# Altium schematic sheet Sch_Buck.SchDoc
size A4; ENG_APP_DATE: --/--/--; DSN_APP_DATE: --/--/--; CHK_APP_DATE: --/--/--; CompanyName: Universidade Federal de Santa Maria; Organization: Universidade Federal de Santa Maria; Address1: Av. Roraima 1000; Address2: Camobi; Address3: Santa Maria - RS; Address4: Brasil; SheetNumber: 5; SheetTotal: 6
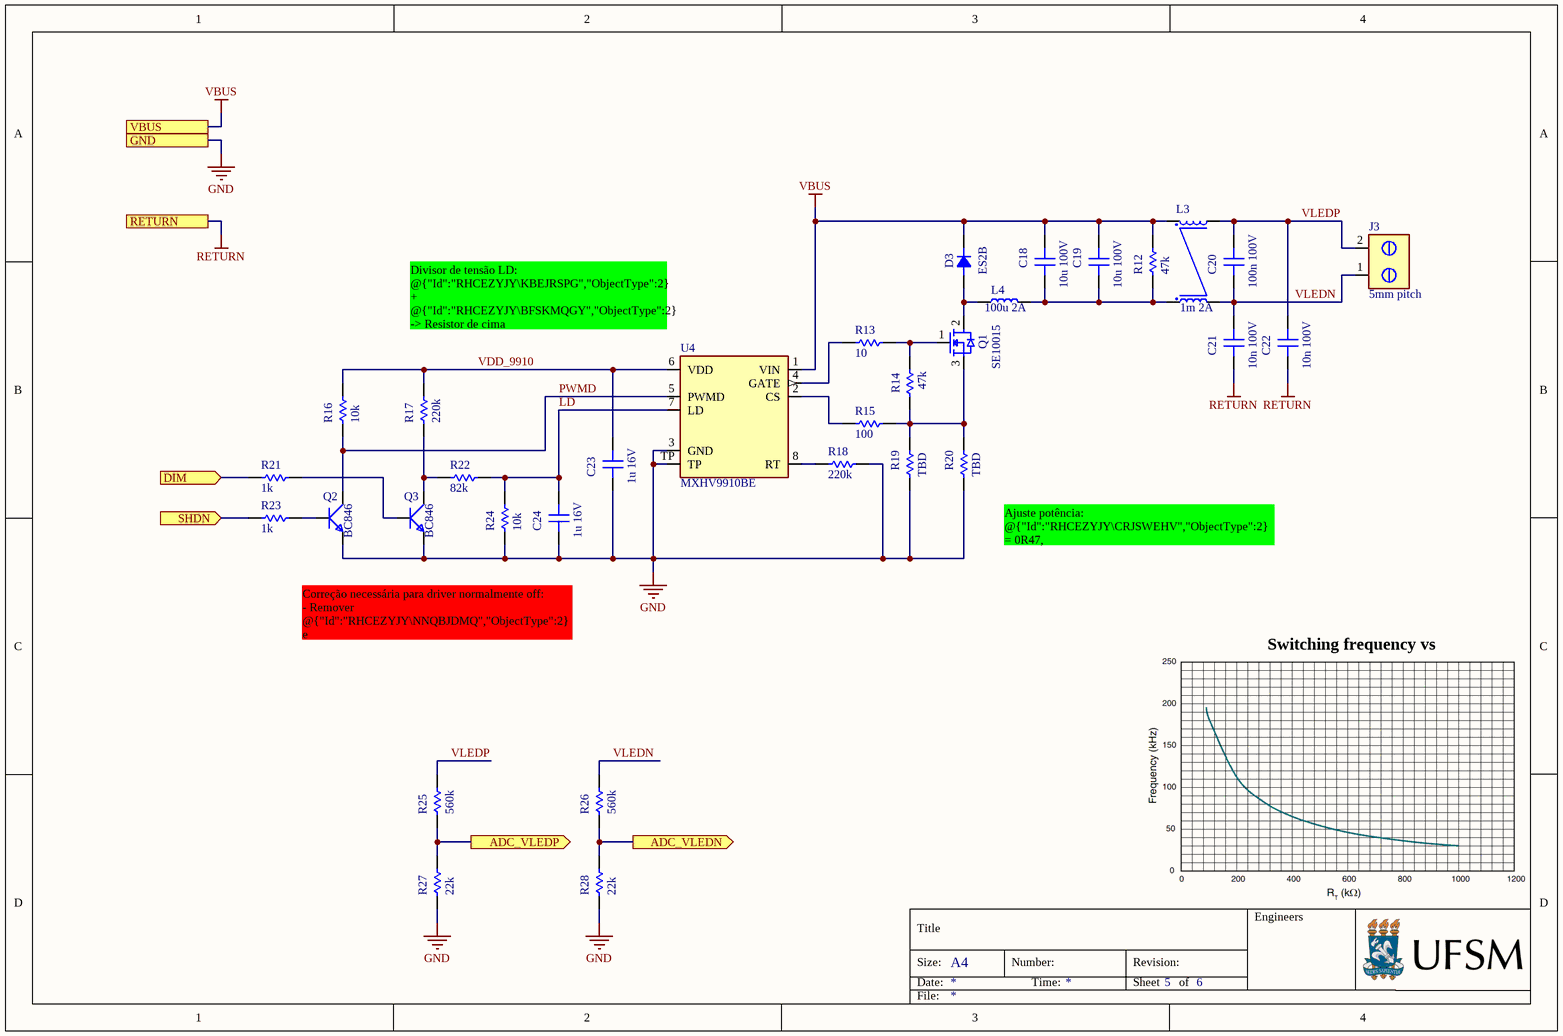
[diagram p0: Sch_Buck.SchDoc]

## Parts
C18  10u 100V  [CAP_SMD_1210]
C19  10u 100V  [CAP_SMD_1210]
C20  100n 100V  [CAP_SMD_1206]
C21  10n 100V  [CAP_SMD_0603]
C22  10n 100V  [CAP_SMD_0603]
C23  1u 16V  [CAP_SMD_0603]
C24  1u 16V  [CAP_SMD_0603]
D3  ES2B  [D_SMA]
J3  5mm pitch  [CON_SCREW_5mm]
L3  1m 2A  [IND_CM_PTH_10x6x5]
L4  100u 2A  [IND_SMD7.1x6.6x5]
Q1  SE10015  [IC_TO252]
Q2  BC846  [IC_SOT23]
Q3  BC846  [IC_SOT23]
R12  47k  [RES_SMD_1206]
R13  10  [RES_SMD_0603]
R14  47k  [RES_SMD_0603]
R15  100  [RES_SMD_0603]
R16  10k  [RES_SMD_0603]
R17  220k  [RES_SMD_0603]
R18  220k  [RES_SMD_0603]
R19  TBD  [RES_SMD_1206]
R20  TBD  [RES_SMD_1206]
R21  1k  [RES_SMD_0603]
R22  82k  [RES_SMD_0603]
R23  1k  [RES_SMD_0603]
R24  10k  [RES_SMD_0603]
R25  560k  [RES_SMD_0603]
R26  560k  [RES_SMD_0603]
R27  22k  [RES_SMD_0603]
R28  22k  [RES_SMD_0603]
U4  MXHV9910BE  [IC_SOIC8_TP]

## Ports
ADC_VLEDN (out), ADC_VLEDP (out), DIM (in), GND, RETURN, SHDN (in), VBUS

## Nets
GND: C23.2 C24.2 Q2.2(E) Q3.2(E) R18.1 R19.2 R20.2 R24.2 R27.2 R28.2 U4.3(GND) U4.TP ; port GND
RETURN: C21.2 C22.2 ; port RETURN
VBUS: C18.1 C19.1 D3.K L3.3 R12.1 U4.1(VIN) ; port VBUS
ADC_VLEDN: R26.2 R28.1 ; port ADC_VLEDN
ADC_VLEDP: R25.2 R27.1 ; port ADC_VLEDP
DIM: R21.2 ; port DIM
LD: C24.1 R22.2 R24.1 U4.7(LD)
PWMD: Q2.3(C) R16.2 U4.5(PWMD)
SHDN: R23.2 ; port SHDN
VDD_9910: C23.1 R16.1 R17.1 U4.6(VDD)
VLEDN: C20.2 C21.1 J3.1 L3.2 R26.1
VLEDP: C20.1 C22.1 J3.2 L3.4 R25.1
NetC18_2: C18.2 C19.2 L3.1 L4.2 R12.2
NetD3_A: D3.A L4.1 Q1.2(D1)
NetQ1_1: Q1.1(G1) R13.2 R14.2
NetQ1_3: Q1.3(S1) R14.1 R15.2 R19.1 R20.1
NetQ2_1: Q2.1(B) R23.1
NetQ3_1: Q3.1(B) R21.1
NetQ3_3: Q3.3(C) R17.2 R22.1
NetR13_1: R13.1 U4.4(GATE)
NetR15_1: R15.1 U4.2(CS)
NetR18_2: R18.2 U4.8(RT)

## Notes on the sheet
- Divisor de tensão LD:
  @{"Id":"RHCEZYJY\KBEJRSPG","ObjectType":2} + @{"Id":"RHCEZYJY\BFSKMQGY","ObjectType":2} -> Resistor de cima
  @{"Id":"RHCEZYJY\OUCGEZBT","ObjectType":2} -> Resistor de baixo
  VDD_9910 = 7.8V. Saída 250mV com DIM 100%
- (near R20) Ajuste potência:
  @{"Id":"RHCEZYJY\CRJSWEHV","ObjectType":2} = 0R47, @{"Id":"RHCEZYJY\AXEUKIXJ","ObjectType":2} = 1R0 ->12.95W @VLED 36V
  @{"Id":"RHCEZYJY\CRJSWEHV","ObjectType":2} = 0R22, @{"Id":"RHCEZYJY\AXEUKIXJ","ObjectType":2} = 1R0 ->25.5W @VLED 36V
- Correção necessária para driver normalmente off:
  - Remover @{"Id":"RHCEZYJY\NNQBJDMQ","ObjectType":2} e @{"Id":"RHCEZYJY\GAUXEEJQ","ObjectType":2}
  - Ligar 10k entre C e E de @{"Id":"RHCEZYJY\GAUXEEJQ","ObjectType":2}
  - Ligar 0R entre @{"Id":"RHCEZYJY\NOSETIQT","ObjectType":2} e @{"Id":"RHCEZYJY\EUNIWYSG","ObjectType":1}
- Switching frequency vs @{"Id":"RHCEZYJY\QCLCCCMT","ObjectType":2} value
- Engineers
- Title
- Size:
- Date:
- A4
- Number:
- Time:
- Revision:
- Sheet
- of
- File:

## Library data of the parts
C18-C24 = CAP_SMD: Capacitor SMD - Generic
D3 = ES1J: 100V 2A Super Fast Recovery Rectifier; Datasheet: https://www.onsemi.com/download/data-sheet/pdf/es1j-d.pdf
J3 = CON_SCREW-2P-5mm: 5mm pitch 2P screw terminal block
L3 = IND_CM_PTH: Common mode inductor PTH- Generic
L4 = IND_SMD: Inductor SMD - Generic
Q1 = MOSFET_SMD: 100V 15A 80mOhm N MOSFET
Q2 Q3 = TRAN_SMD_NPN: SMD transistor NPN - Generic
R12-R28 = RES_SMD: Resistor SMD - Generic
U4 = MXHV9910BE: Off-Line, High Brightness LED Driver; Datasheet: https://www.littelfuse.com/assetdocs/littelfuse-integrated-circuits-mxhv9910-datasheet?assetguid=0135616d-093f-45d8-8766-b0e533f2ef99